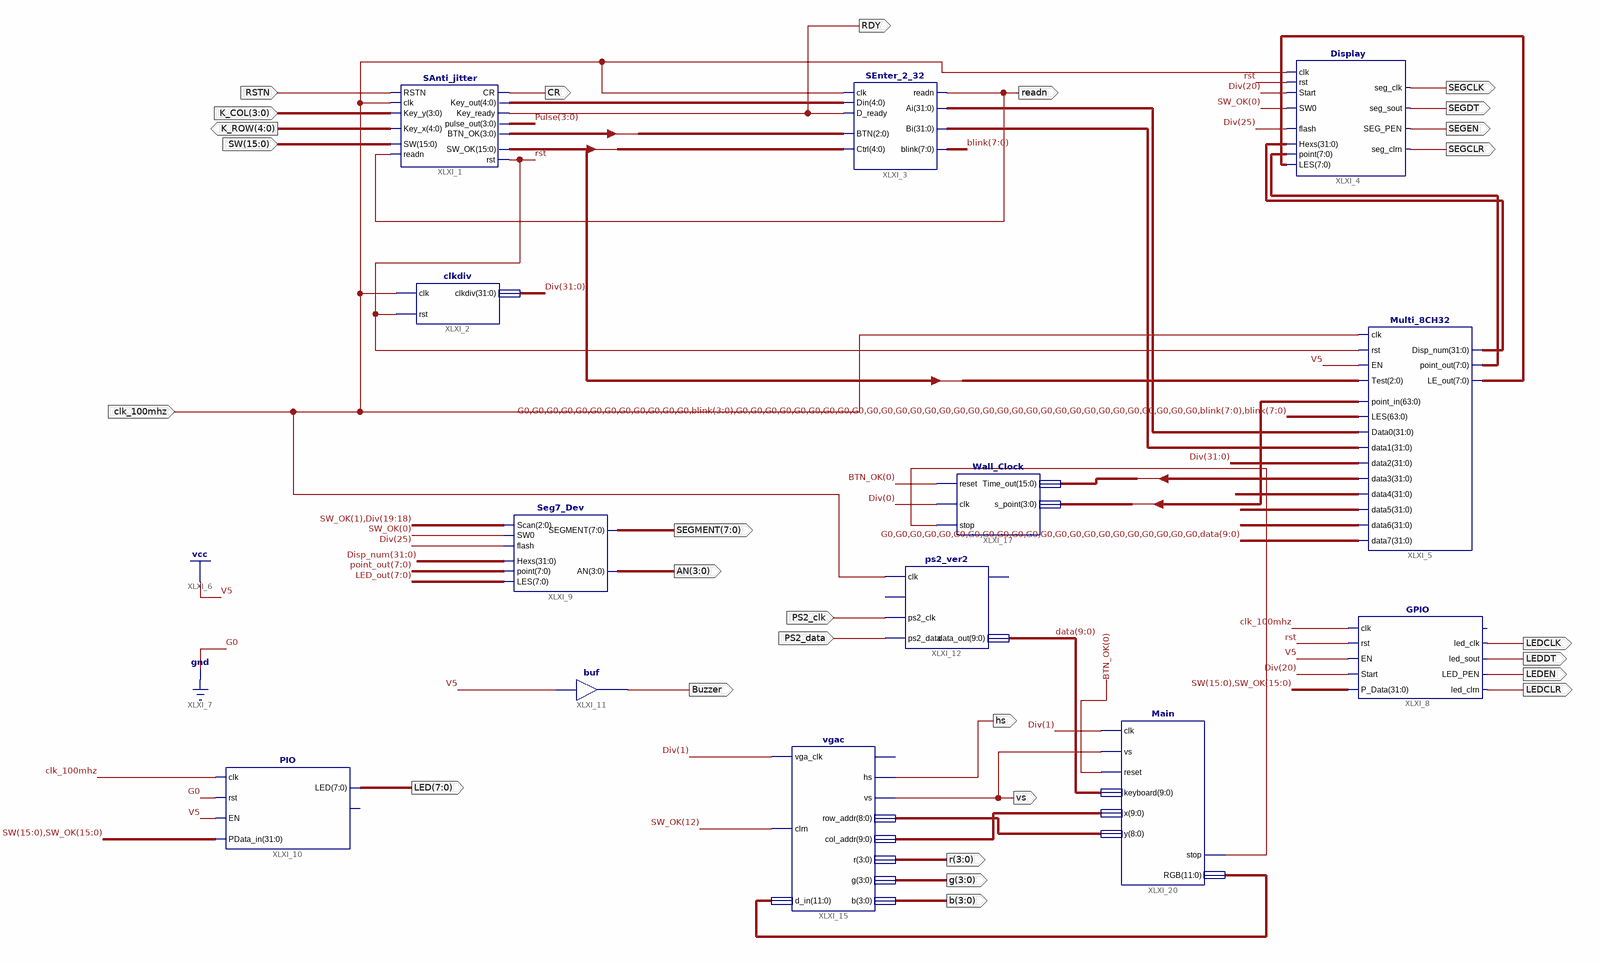
[diagram p0: schematic sheet 1]
// Xilinx ISE schematic Framework.sch (kintex7) as structural Verilog: 13 symbols, 27 ports
module Framework (
  input  RSTN,
  input  [3:0] K_COL,
  input  [15:0] SW,
  input  clk_100mhz,
  input  PS2_clk,
  input  PS2_data,
  output [4:0] K_ROW,
  output readn,
  output RDY,
  output CR,
  output SEGCLK,
  output SEGDT,
  output SEGEN,
  output SEGCLR,
  output LEDCLK,
  output LEDDT,
  output LEDEN,
  output LEDCLR,
  output [7:0] SEGMENT,
  output [3:0] AN,
  output Buzzer,
  output [7:0] LED,
  output [3:0] r,
  output [3:0] g,
  output [3:0] b,
  output vs,
  output hs
);

  wire rst, XLXN_69;
  wire [3:0] BTN_OK, Pulse;
  wire [4:0] XLXN_18;
  wire [7:0] blink, LED_out, point_out, XLXN_32, XLXN_33;
  wire [8:0] XLXN_67;
  wire [9:0] data, XLXN_68;
  wire [11:0] XLXN_62;
  wire [15:0] SW_OK;
  wire [31:0] Ai, Bi, Disp_num, Div, timer, XLXN_31, XLXN_46, XLXN_47, XLXN_48;
  wire [63:0] s_point;

  SAnti_jitter XLXI_1 (
    .SW(SW), .readn(readn), .Key_y(K_COL), .Key_x(K_ROW), .RSTN(RSTN), .clk(clk_100mhz), .Key_out(XLXN_18),
    .Key_ready(RDY), .CR(CR), .rst(rst), .SW_OK(SW_OK), .pulse_out(Pulse), .BTN_OK(BTN_OK));
  clkdiv XLXI_2 (.clk(clk_100mhz), .rst(rst), .clkdiv(Div));
  SEnter_2_32 XLXI_3 (
    .readn(readn), .Ai(Ai), .Bi(Bi), .blink(blink), .Din(XLXN_18), .D_ready(RDY), .clk(clk_100mhz),
    .Ctrl({SW_OK[7:5], SW_OK[15], SW_OK[0]}), .BTN(BTN_OK[2:0]));
  Display XLXI_4 (
    .LES(XLXN_33), .SEG_PEN(SEGEN), .seg_sout(SEGDT), .seg_clrn(SEGCLR), .point(XLXN_32), .Hexs(XLXN_31),
    .SW0(SW_OK[0]), .flash(Div[25]), .seg_clk(SEGCLK), .clk(clk_100mhz), .rst(rst), .Start(Div[20]));
  Multi_8CH32 XLXI_5 (
    .Test(SW_OK[7:5]), .point_in(s_point), .EN(1'b1), .clk(clk_100mhz), .rst(rst),
    .LES({{12{1'b0}}, blink[3:0], {32{1'b0}}, blink, blink}), .Data0(Ai), .data1(Bi), .data2(Div),
    .data3(timer), .data4(XLXN_46), .data5(XLXN_47), .data6(XLXN_48), .data7({{22{1'b0}}, data}),
    .point_out(XLXN_32), .LE_out(XLXN_33), .Disp_num(XLXN_31));
  GPIO XLXI_8 (
    .clk(clk_100mhz), .P_Data({SW, SW_OK}), .rst(rst), .EN(1'b1), .Start(Div[20]), .led_clrn(LEDCLR),
    .led_clk(LEDCLK), .led_sout(LEDDT), .LED_PEN(LEDEN));  // open: GPIOf0
  Seg7_Dev XLXI_9 (
    .LES(LED_out), .Scan({SW_OK[1], Div[19:18]}), .SEGMENT(SEGMENT), .AN(AN), .point(point_out),
    .flash(Div[25]), .SW0(SW_OK[0]), .Hexs(Disp_num));
  buf XLXI_11 (Buzzer, 1'b1);
  ps2_ver2 XLXI_12 (.clk(clk_100mhz), .ps2_clk(PS2_clk), .ps2_data(PS2_data), .data_out(data));  // open: rst, ready
  PIO XLXI_10 (.clk(clk_100mhz), .rst(1'b0), .EN(1'b1), .PData_in({SW, SW_OK}), .LED(LED));  // open: GPIOf0
  vgac XLXI_15 (
    .vga_clk(Div[1]), .clrn(SW_OK[12]), .d_in(XLXN_62), .hs(hs), .vs(vs), .row_addr(XLXN_67),
    .col_addr(XLXN_68), .r(r), .g(g), .b(b));  // open: rdn
  Wall_Clock XLXI_17 (.reset(BTN_OK[0]), .clk(Div[0]), .Time_out(timer[15:0]), .s_point(s_point[3:0]), .stop(XLXN_69));
  Main XLXI_20 (
    .clk(Div[1]), .vs(vs), .reset(BTN_OK[0]), .keyboard(data), .x(XLXN_68), .y(XLXN_67), .stop(XLXN_69),
    .RGB(XLXN_62));
endmodule
